# Altium project Drone1_V1.PrjPcb
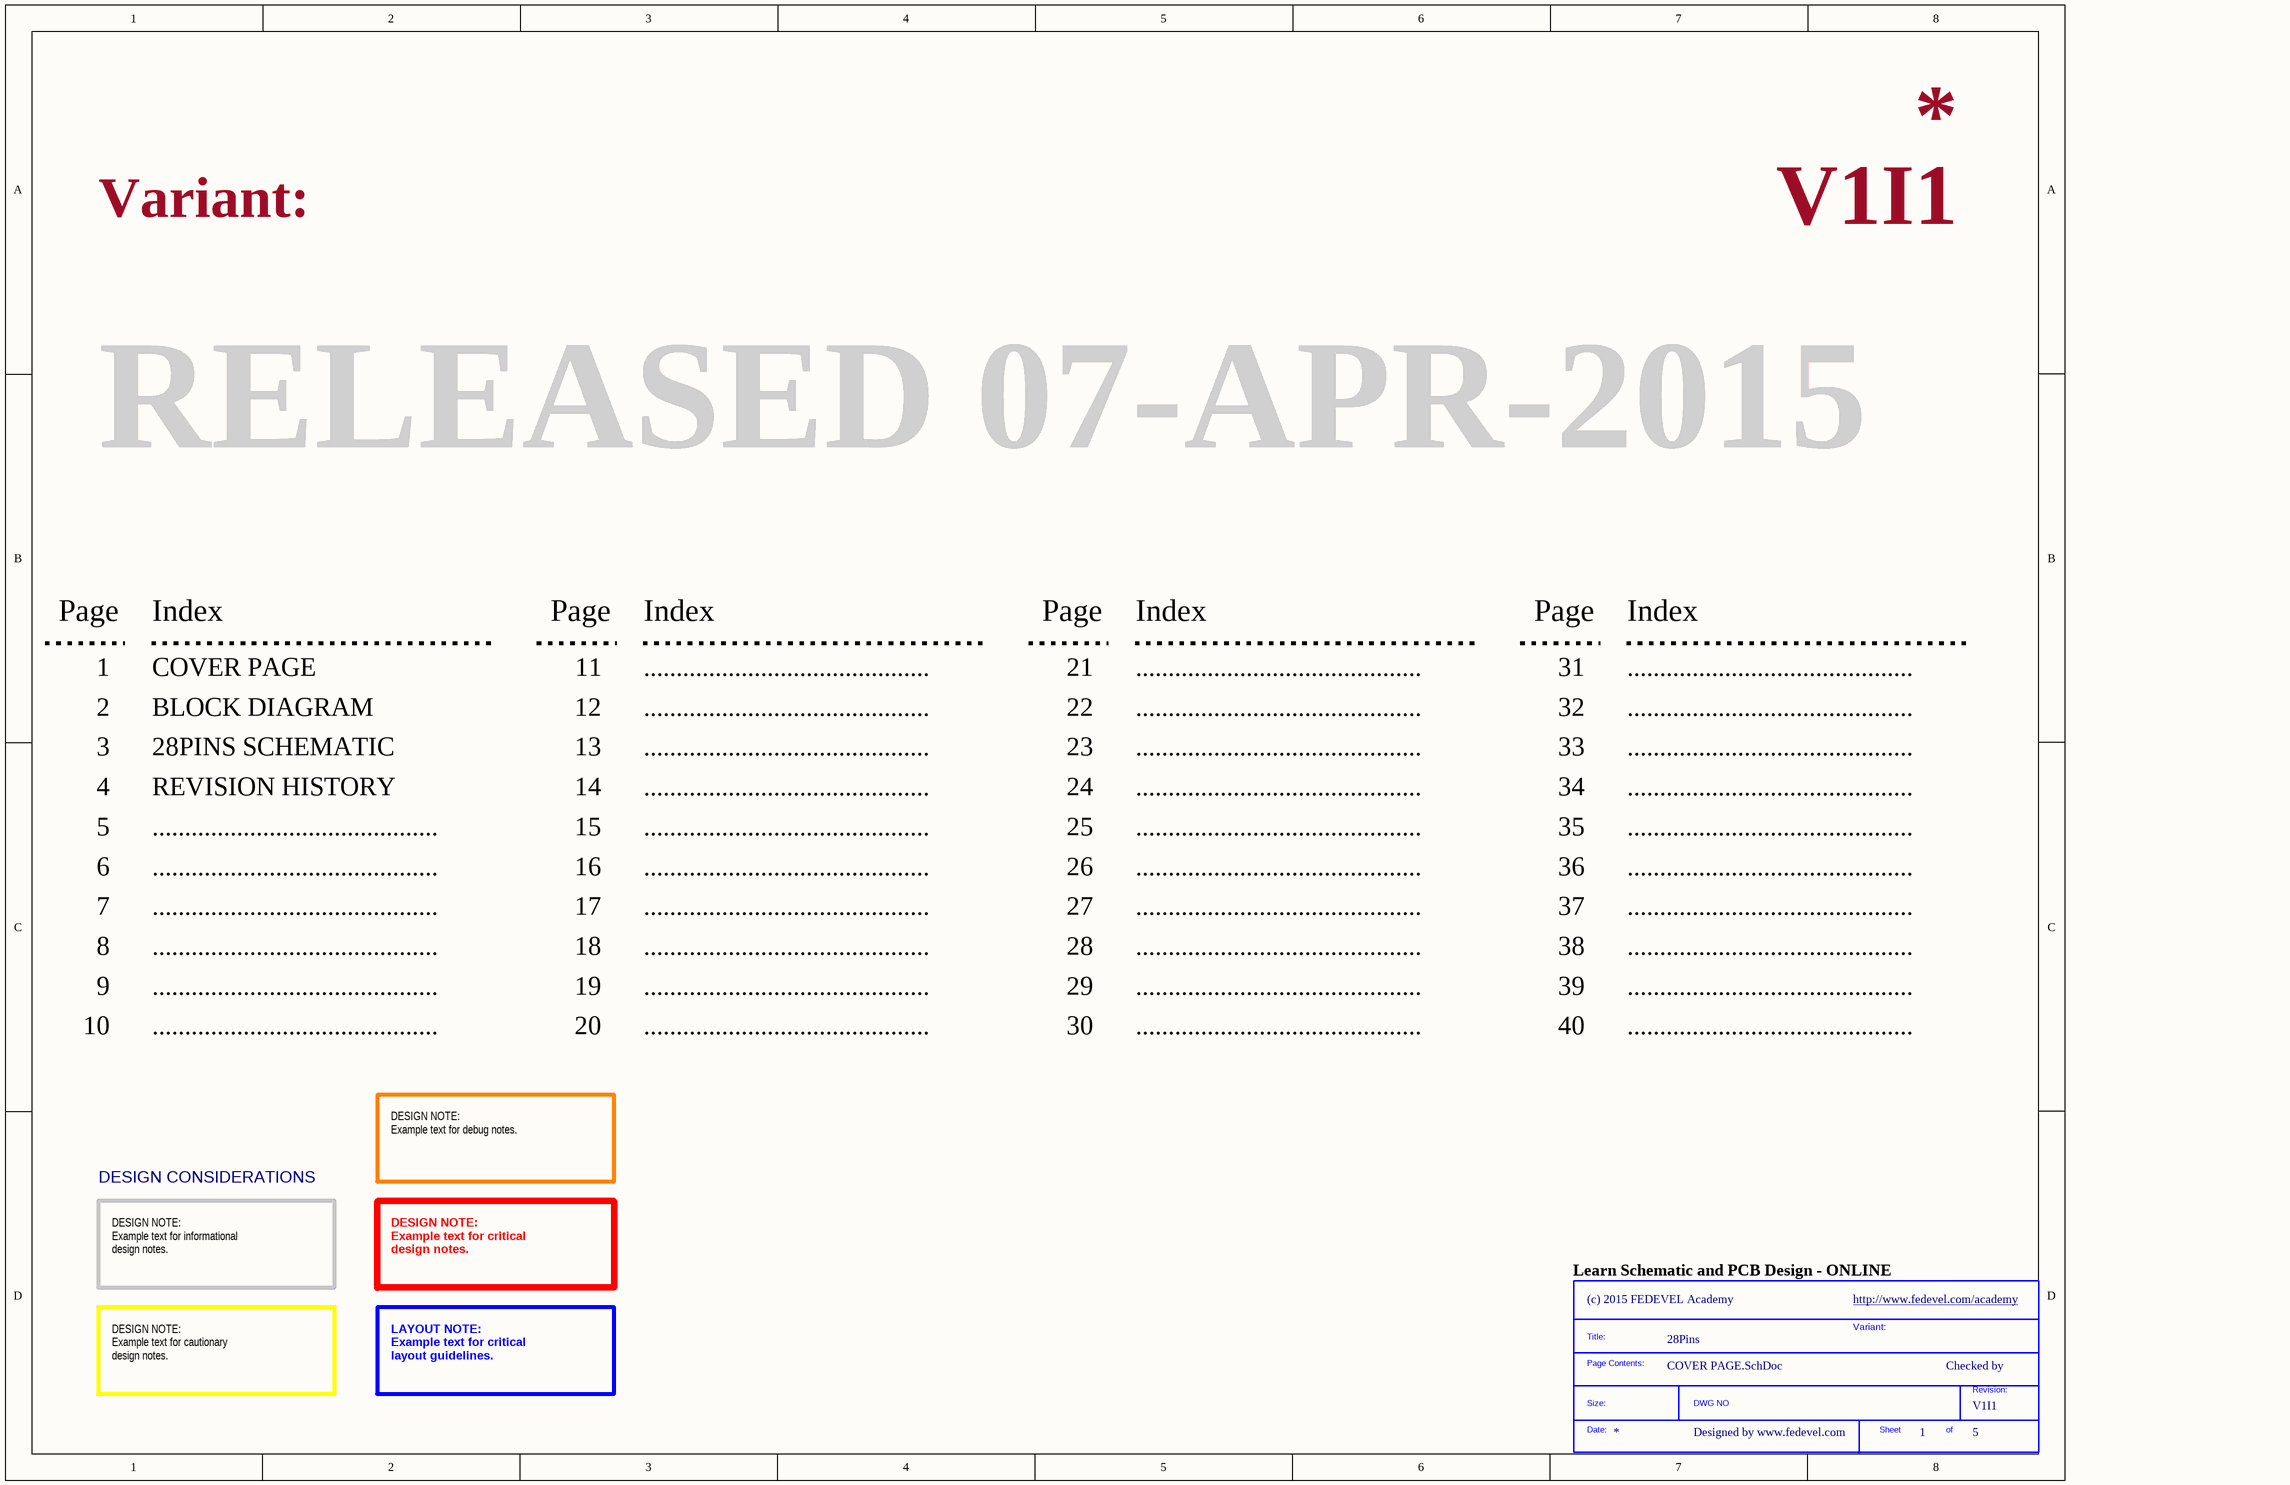
[diagram p0: COVER PAGE.SchDoc]
ClientCompanyName: FEDEVEL Academy; ClientContactEmail: robert.feranec@fedevel.com; ClientContactName: Robert Feranec; ClientWebsite: www.fedevel.com; Company: (c) 2015 FEDEVEL Academy; NotFitted: NF; Project: 28Pins; VersionRevision: V1I1
5 sheets, 23 parts. Net scope: hierarchical (ports join the sheet entries above them; power ports are global).
Sheets:
  COVER PAGE.SchDoc
  Drone1_V1 SCHEMATIC.SchDoc
    U_Moteurs_schem = Moteurs_schem.SchDoc
    U_Mission_schem = Mission_schem.SchDoc
    U_Vol_schem = Vol_schem.SchDoc

## Sheet COVER PAGE.SchDoc
size A3; DocumentNumber: 1; SheetNumber: 1; SheetTotal: 5

### Parts
(Parts that share a designator on the sheet are numbered #1, #2 ... from top to bottom, then left to right.)
*#1  SDTitleBlock  (value not drawn)  (graphical)

### Notes on the sheet
- Variant:
- RELEASED 07-APR-2015
- Page
- Index
- 1
- COVER PAGE
- 11
- ............................................
- 21
- 31
- 2
- 3
- BLOCK DIAGRAM
- 28PINS SCHEMATIC
- 12
- 13
- 22
- 23
- 32
- 33
- 4
- 5
- REVISION HISTORY
- 14
- 15
- 24
- 25
- 34
- 35
- 6
- 16
- 26
- 36
- 7
- 8
- 17
- 18
- 27
- 28
- 37
- 38
- 9
- 10
- 19
- 20
- 29
- 30
- 39
- 40
- DESIGN NOTE:
  Example text for debug notes.
- DESIGN CONSIDERATIONS
- DESIGN NOTE:
  Example text for informational
  design notes.
- DESIGN NOTE:
  Example text for critical
  design notes.
- (near *#1) Learn Schematic and PCB Design - ONLINE
- http://www.fedevel.com/academy
- Checked by
- DESIGN NOTE:
  Example text for cautionary
  design notes.
- LAYOUT NOTE:
  Example text for critical
  layout guidelines.
- Designed by www.fedevel.com
- (in symbol SDTitleBlock) Title:; Page Contents:; Revision:; Size:; DWG NO; Date:; Sheet; of

## Sheet Drone1_V1 SCHEMATIC.SchDoc
size A4; DocumentNumber: 3; SheetNumber: 3; SheetTotal: 5; PageSetup: Record=PageOptions|CenterHorizontal=True|CenterVertical=True|PrintScale=0.73|XCorrection=1.00|YCorrection=1.00|PrintKind=0|BorderSize=5000000|LeftOffset=0|BottomOffset=0|Orientation=2|PaperLength=1000|PaperWidth=1000|Scale=100|PaperSource=7|PrintQuality=-3|MediaType=1|DitherType=10|PrintScaleMode=1|PaperKind=A3|PaperIndex=8
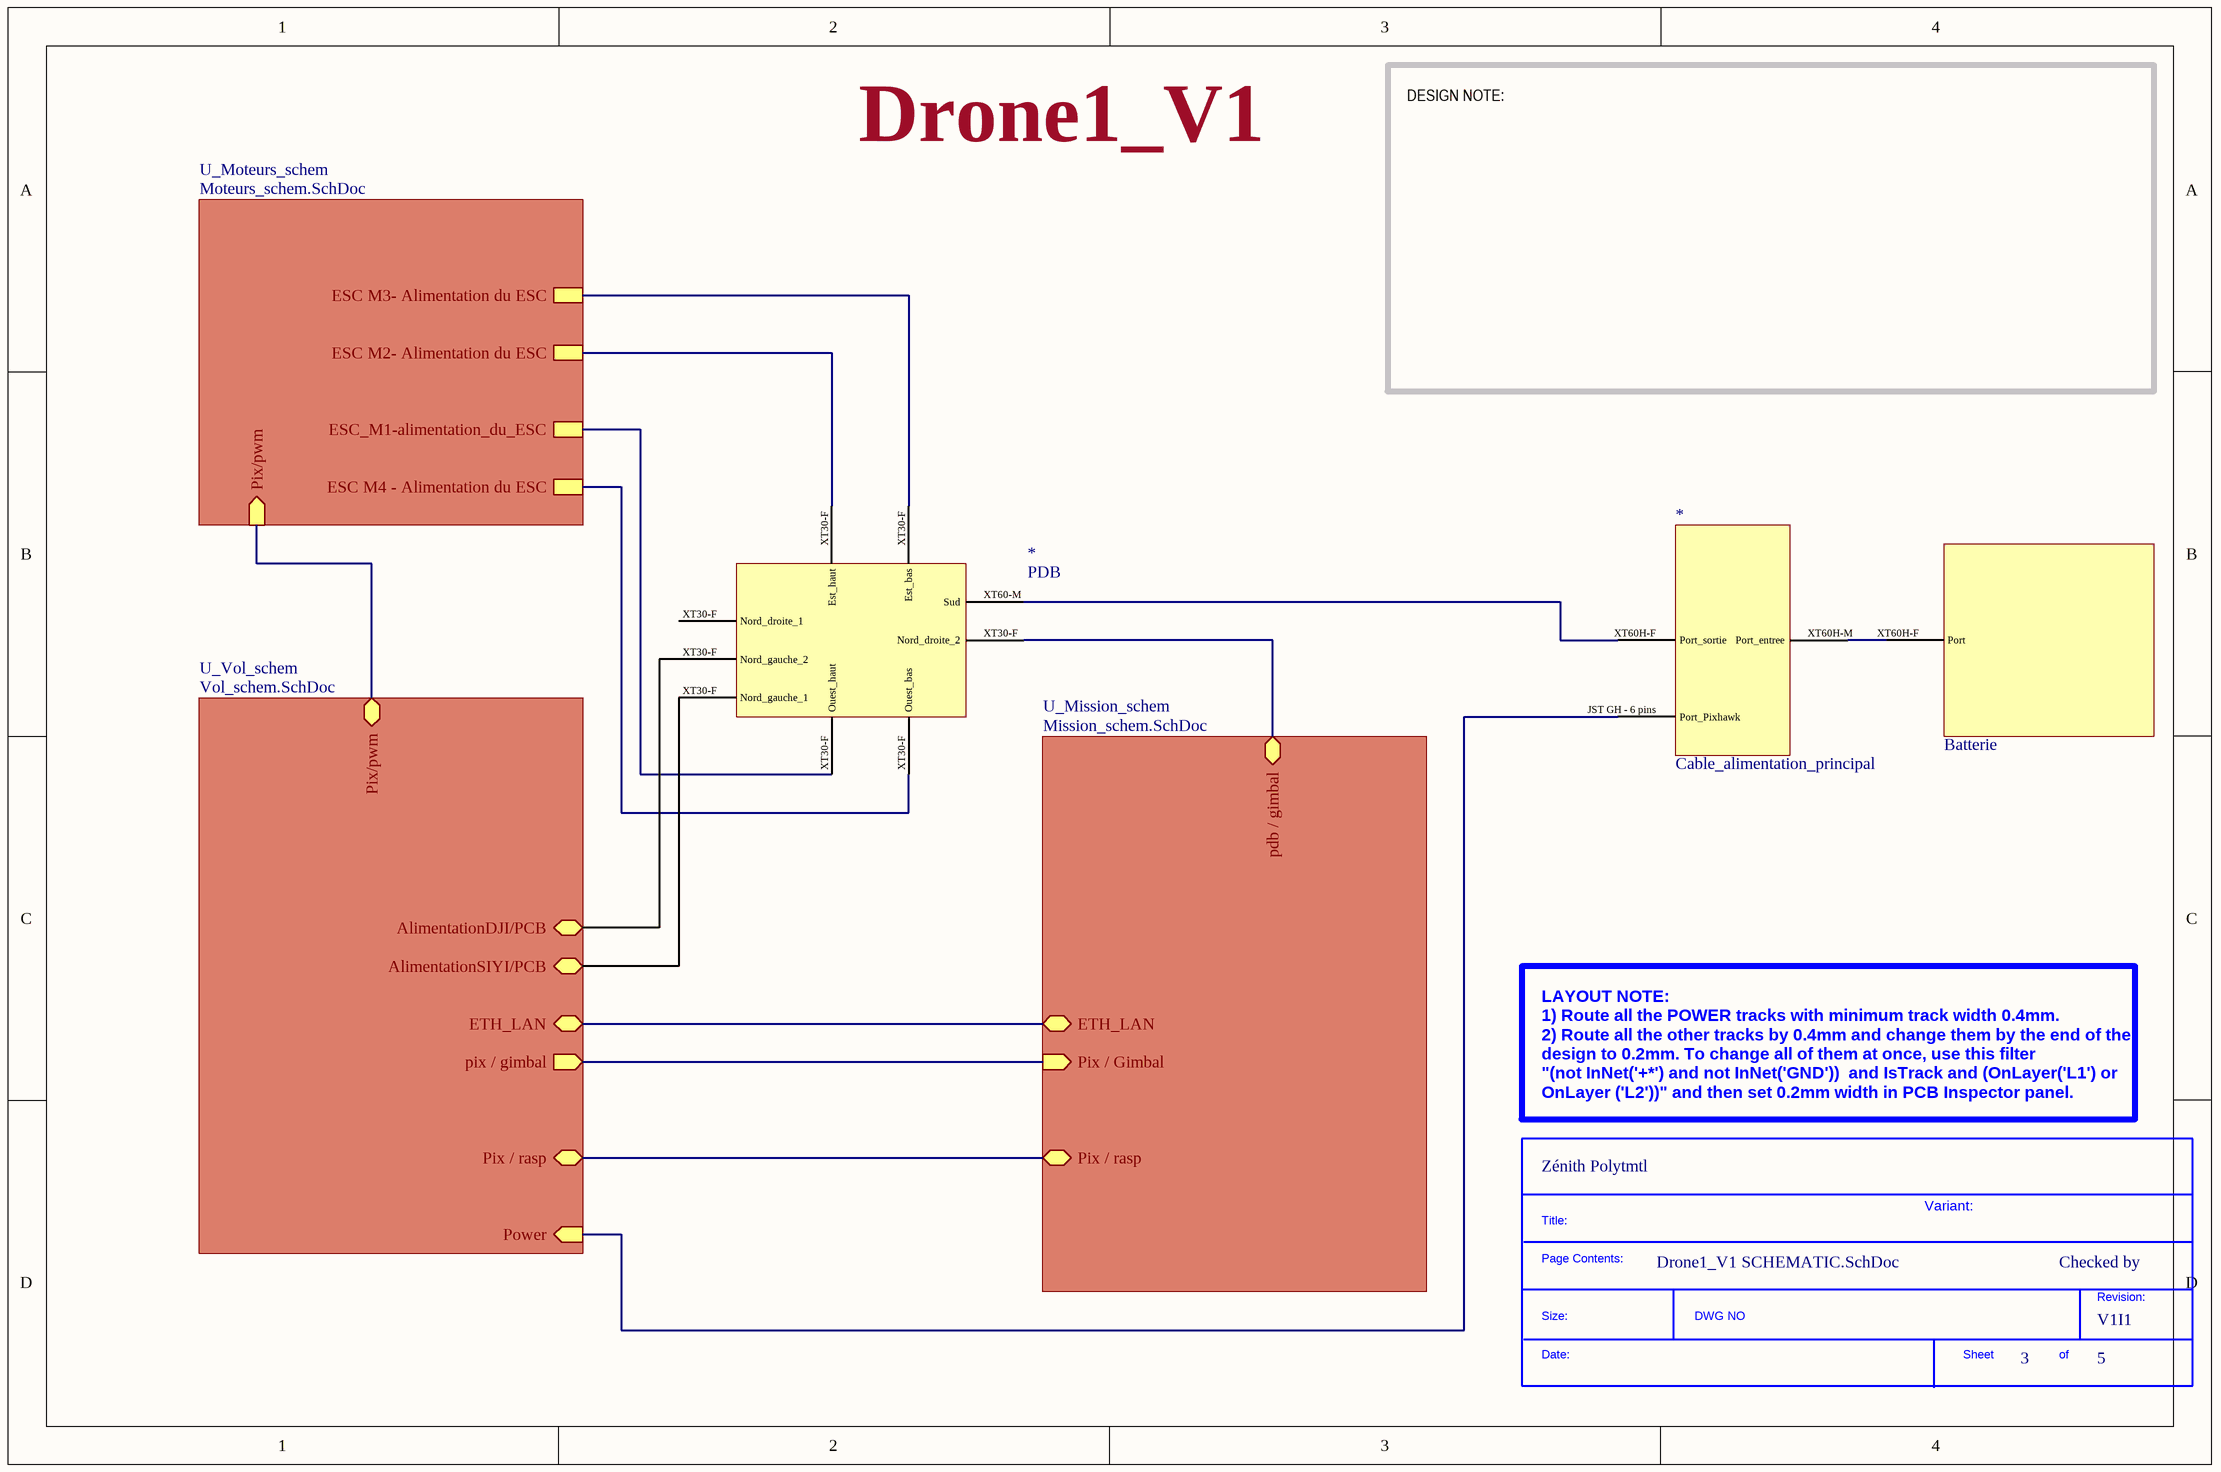
[diagram p1: Drone1_V1 SCHEMATIC.SchDoc]

### Parts
(Parts that share a designator on the sheet are numbered #1, #2 ... from top to bottom, then left to right.)
*#2  Cable_alimentation_principal
*#3  PDB
*#4  SDTitleBlock  (value not drawn)  (graphical)
?  Batterie

### Sub-sheets
U_Mission_schem = Mission_schem.SchDoc: ETH_LAN (bidir), Pix / Gimbal (in), Pix / rasp (bidir), pdb / gimbal (bidir)
U_Moteurs_schem = Moteurs_schem.SchDoc: ESC M3- Alimentation du ESC, ESC_M1-alimentation_du_ESC, ESC M4 - Alimentation du ESC, ESC M2- Alimentation du ESC, Pix/pwm (in)
U_Vol_schem = Vol_schem.SchDoc: ETH_LAN (bidir), Power (in), pix / gimbal (out), Pix / rasp (bidir), Pix/pwm (bidir), AlimentationSIYI/PCB (bidir), AlimentationDJI/PCB (bidir)

### Nets
ESC M2- Alimentation du ESC: *#3.XT30-F(Est_haut) ; sheet U_Moteurs_schem/ESC M2- Alimentation du ESC
ESC M3- Alimentation du ESC: *#3.XT30-F(Est_bas) ; sheet U_Moteurs_schem/ESC M3- Alimentation du ESC
ESC M4 - Alimentation du ESC: *#3.XT30-F(Ouest_bas) ; sheet U_Moteurs_schem/ESC M4 - Alimentation du ESC
ESC_M1-alimentation_du_ESC: *#3.XT30-F(Ouest_haut) ; sheet U_Moteurs_schem/ESC_M1-alimentation_du_ESC
ETH_LAN: sheet U_Mission_schem/ETH_LAN, sheet U_Vol_schem/ETH_LAN
pdb / gimbal: *#3.XT30-F(Nord_droite_2) ; sheet U_Mission_schem/Pix / Gimbal, sheet U_Mission_schem/pdb / gimbal, sheet U_Vol_schem/pix / gimbal
Pix / rasp: sheet U_Mission_schem/Pix / rasp, sheet U_Vol_schem/Pix / rasp
Pix/pwm: sheet U_Moteurs_schem/Pix/pwm, sheet U_Vol_schem/Pix/pwm
Power: *#2.JST_GH_-_6_pins(Port_Pixhawk) ; sheet U_Vol_schem/Power
Net*#2_XT60H-F: *#2.XT60H-F(Port_sortie) *#3.XT60-M(Sud)
Net*#2_XT60H-M: *#2.XT60H-M(Port_entree) ?.XT60H-F(Port)

### Notes on the sheet
- Drone1_V1
- DESIGN NOTE:
- (near *#4) Zénith Polytmtl
- (near *#4) LAYOUT NOTE:
  1) Route all the POWER tracks with minimum track width 0.4mm.
  2) Route all the other tracks by 0.4mm and change them by the end of the design to 0.2mm. To change all of them at once, use this filter
  "(not InNet('+*') and not InNet('GND'))  and IsTrack and (OnLayer('L1') or OnLayer ('L2'))" and then set 0.2mm width in PCB Inspector panel.
- Variant:
- Checked by
- (in symbol SDTitleBlock) Title:; Page Contents:; Revision:; Size:; DWG NO; Date:; Sheet; of

## Sheet Moteurs_schem.SchDoc
size A4
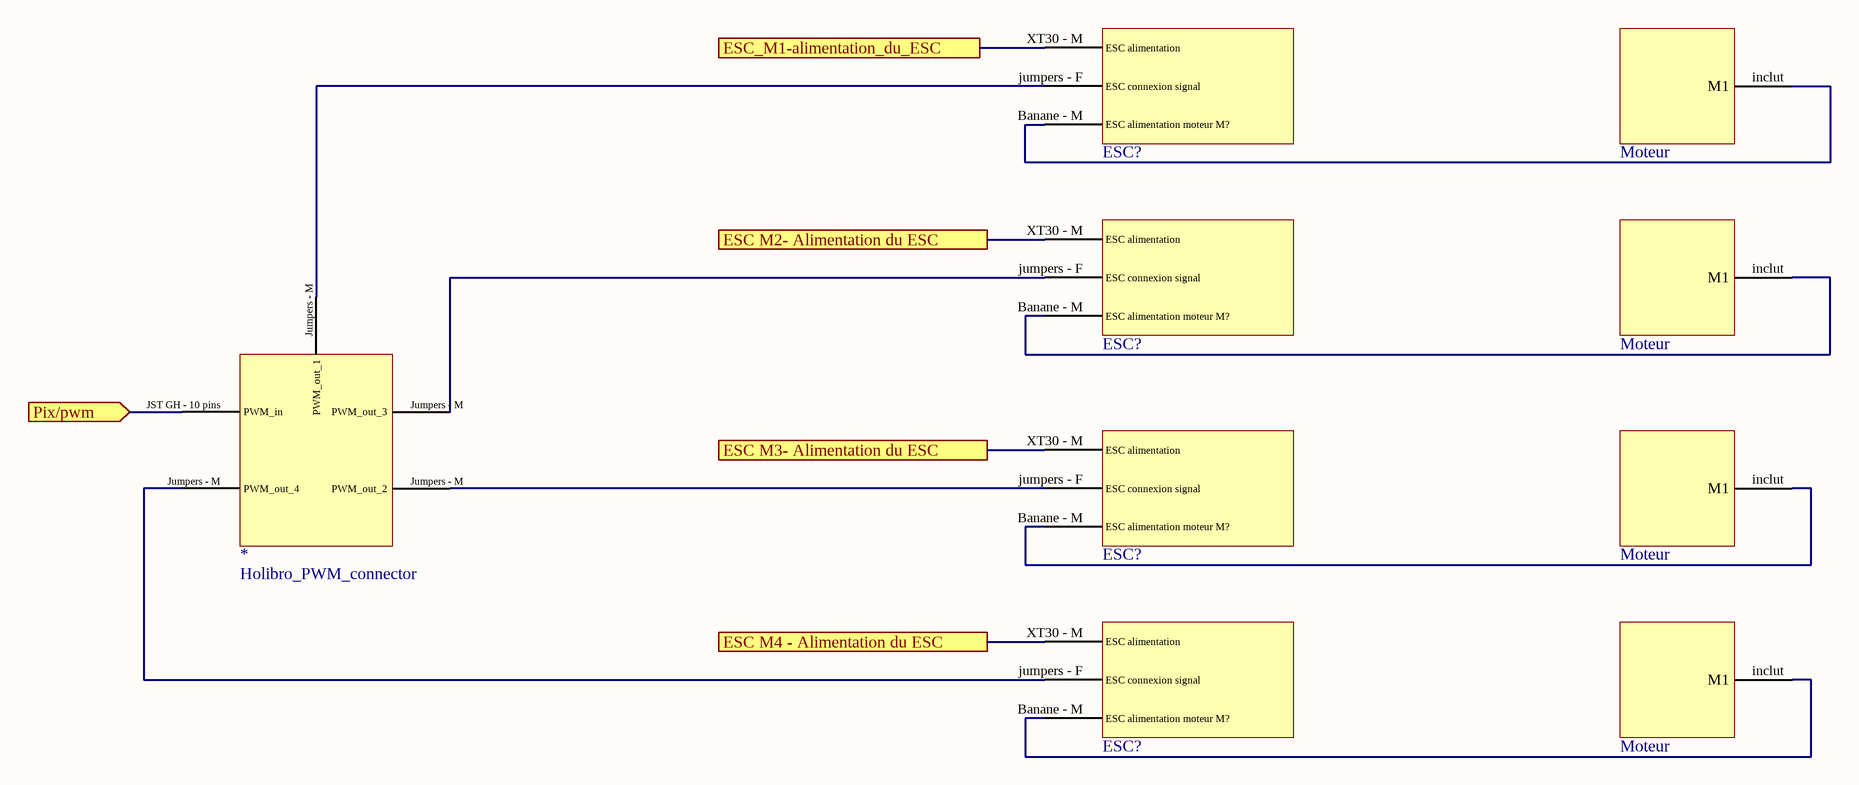
[diagram p2: Moteurs_schem.SchDoc]

### Parts
(Parts that share a designator on the sheet are numbered #1, #2 ... from top to bottom, then left to right.)
*#5  Holibro_PWM_connector
ESC?#1  ESC  (value not drawn)
ESC?#2  ESC  (value not drawn)
ESC?#3  ESC  (value not drawn)
ESC?#4  ESC  (value not drawn)
M?#1  Moteur
M?#2  Moteur
M?#3  Moteur
M?#4  Moteur

### Ports
ESC M2- Alimentation du ESC, ESC M3- Alimentation du ESC, ESC M4 - Alimentation du ESC, ESC_M1-alimentation_du_ESC, Pix/pwm (in)

### Nets
ESC M2- Alimentation du ESC: ESC?#2.XT30_-_M(ESC_alimentation) ; port ESC M2- Alimentation du ESC
ESC M3- Alimentation du ESC: ESC?#3.XT30_-_M(ESC_alimentation) ; port ESC M3- Alimentation du ESC
ESC M4 - Alimentation du ESC: ESC?#4.XT30_-_M(ESC_alimentation) ; port ESC M4 - Alimentation du ESC
ESC_M1-alimentation_du_ESC: ESC?#1.XT30_-_M(ESC_alimentation) ; port ESC_M1-alimentation_du_ESC
Pix/pwm: *#5.JST_GH_-_10_pins(PWM_in) ; port Pix/pwm
Net*#5_Jumpers - M: *#5.Jumpers_-_M(PWM_out_1) ESC?#1.jumpers_-_F(ESC_connexion_signal)
Net*#5_Jumpers - M: *#5.Jumpers_-_M(PWM_out_3) ESC?#2.jumpers_-_F(ESC_connexion_signal)  [a separate net that carries the same name]
Net*#5_Jumpers - M: *#5.Jumpers_-_M(PWM_out_2) ESC?#3.jumpers_-_F(ESC_connexion_signal)  [a separate net that carries the same name]
Net*#5_Jumpers - M: *#5.Jumpers_-_M(PWM_out_4) ESC?#4.jumpers_-_F(ESC_connexion_signal)  [a separate net that carries the same name]
NetESC?#1_Banane - M: ESC?#1.Banane_-_M(ESC_alimentation_moteur_M?) M?#1.inclut(M1)
NetESC?#2_Banane - M: ESC?#2.Banane_-_M(ESC_alimentation_moteur_M?) M?#2.inclut(M1)
NetESC?#3_Banane - M: ESC?#3.Banane_-_M(ESC_alimentation_moteur_M?) M?#3.inclut(M1)
NetESC?#4_Banane - M: ESC?#4.Banane_-_M(ESC_alimentation_moteur_M?) M?#4.inclut(M1)

## Sheet Mission_schem.SchDoc
size A4
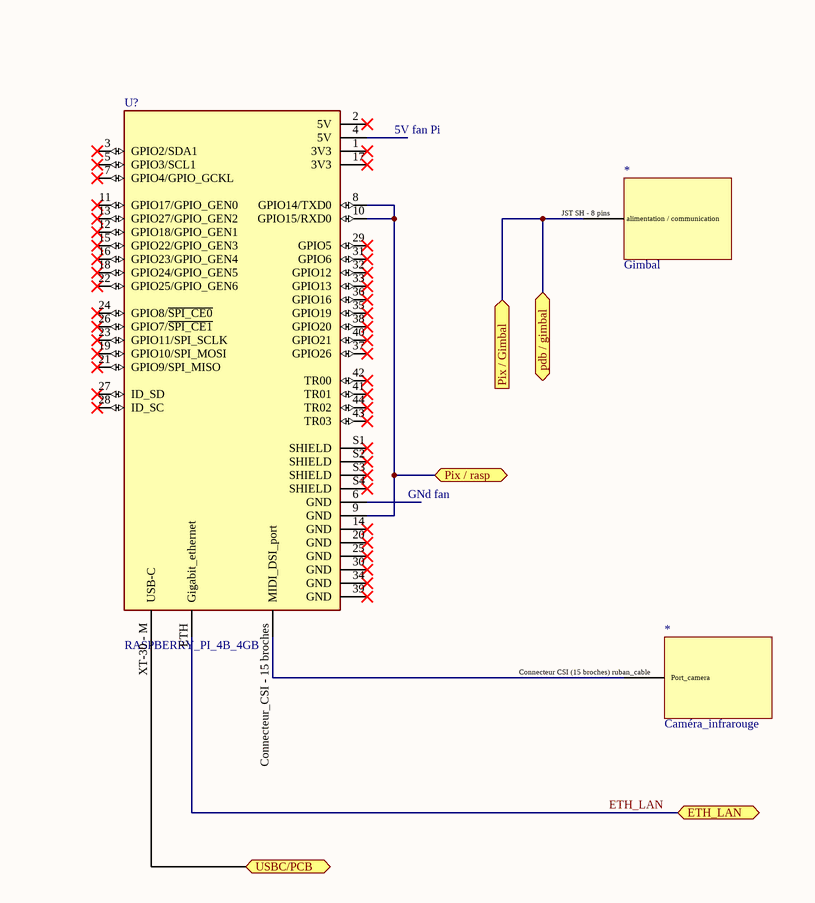
[diagram p3: Mission_schem.SchDoc, right]

### Parts
(Parts that share a designator on the sheet are numbered #1, #2 ... from top to bottom, then left to right.)
*#6  Gimbal
*#7  Caméra_infrarouge
U?  RASPBERRY_PI_4B_4GB  [MODULE_RASPBERRY_PI_4B_4GB]

### Ports
ETH_LAN (bidir), pdb / gimbal (bidir), Pix / Gimbal (in), Pix / rasp (bidir), USBC/PCB (bidir)

### Nets
ETH_LAN: U?.ETH(Gigabit_ethernet) ; port ETH_LAN
pdb / gimbal: *#6.JST_SH_-_8_pins(alimentation_/_communication) ; port Pix / Gimbal, port pdb / gimbal
Pix / rasp: U?.8(GPIO14/TXD0) U?.9(GND) U?.10(GPIO15/RXD0) ; port Pix / rasp
Net*#7_Connecteur CSI (15 broches) ruban_cable: *#7.Connecteur_CSI_(15_broches)_ruban_cable(Port_camera) U?.Connecteur_CSI_-_15_broches(MIDI_DSI_port)

Not connected (* = marked no-connect by the designer): U? 1(3V3)* 2(5V)* 3(GPIO2/SDA1)* 4(5V) 5(GPIO3/SCL1)* 6(GND) 7(GPIO4/GPIO_GCKL)* 11(GPIO17/GPIO_GEN0)* 12(GPIO18/GPIO_GEN1)* 13(GPIO27/GPIO_GEN2)* 14(GND)* 15(GPIO22/GPIO_GEN3)* 16(GPIO23/GPIO_GEN4)* 17(3V3)* 18(GPIO24/GPIO_GEN5)* 19(GPIO10/SPI_MOSI)* 20(GND)* 21(GPIO9/SPI_MISO)* 22(GPIO25/GPIO_GEN6)* 23(GPIO11/SPI_SCLK)* 24(GPIO8/~{SPI_CE0})* 25(GND)* 26(GPIO7/~{SPI_CE1})* 27(ID_SD)* 28(ID_SC)* 29(GPIO5)* 30(GND)* 31(GPIO6)* 32(GPIO12)* 33(GPIO13)* 34(GND)* 35(GPIO19)* 36(GPIO16)* 37(GPIO26)* 38(GPIO20)* 39(GND)* 40(GPIO21)* 41(TR01)* 42(TR00)* 43(TR03)* 44(TR02)* S1(SHIELD)* S2(SHIELD)* S3(SHIELD)* S4(SHIELD)* XT-30 - M(USB-C_)

### Notes on the sheet
- 5V fan Pi
- GNd fan

### Library data of the parts
U? = RASPBERRY_PI_4B_4GB: BCM2711 Raspberry Pi 4 Model B 4GB - ARMÂ® CortexÂ®-A72 MPU Embedded Evaluation Board; MP: RASPBERRY PI 4B/4GB; SnapEDA_Link: https://www.snapeda.com/parts/RASPBERRY%20PI%204B/4GB/Raspberry+Pi/view-part/?ref=snap; Package: None; Value: *; MF: Raspberry Pi; Check_prices: https://www.snapeda.com/parts/RASPBERRY%20PI%204B/4GB/Raspberry+Pi/view-part/?ref=eda

## Sheet Vol_schem.SchDoc
size A4
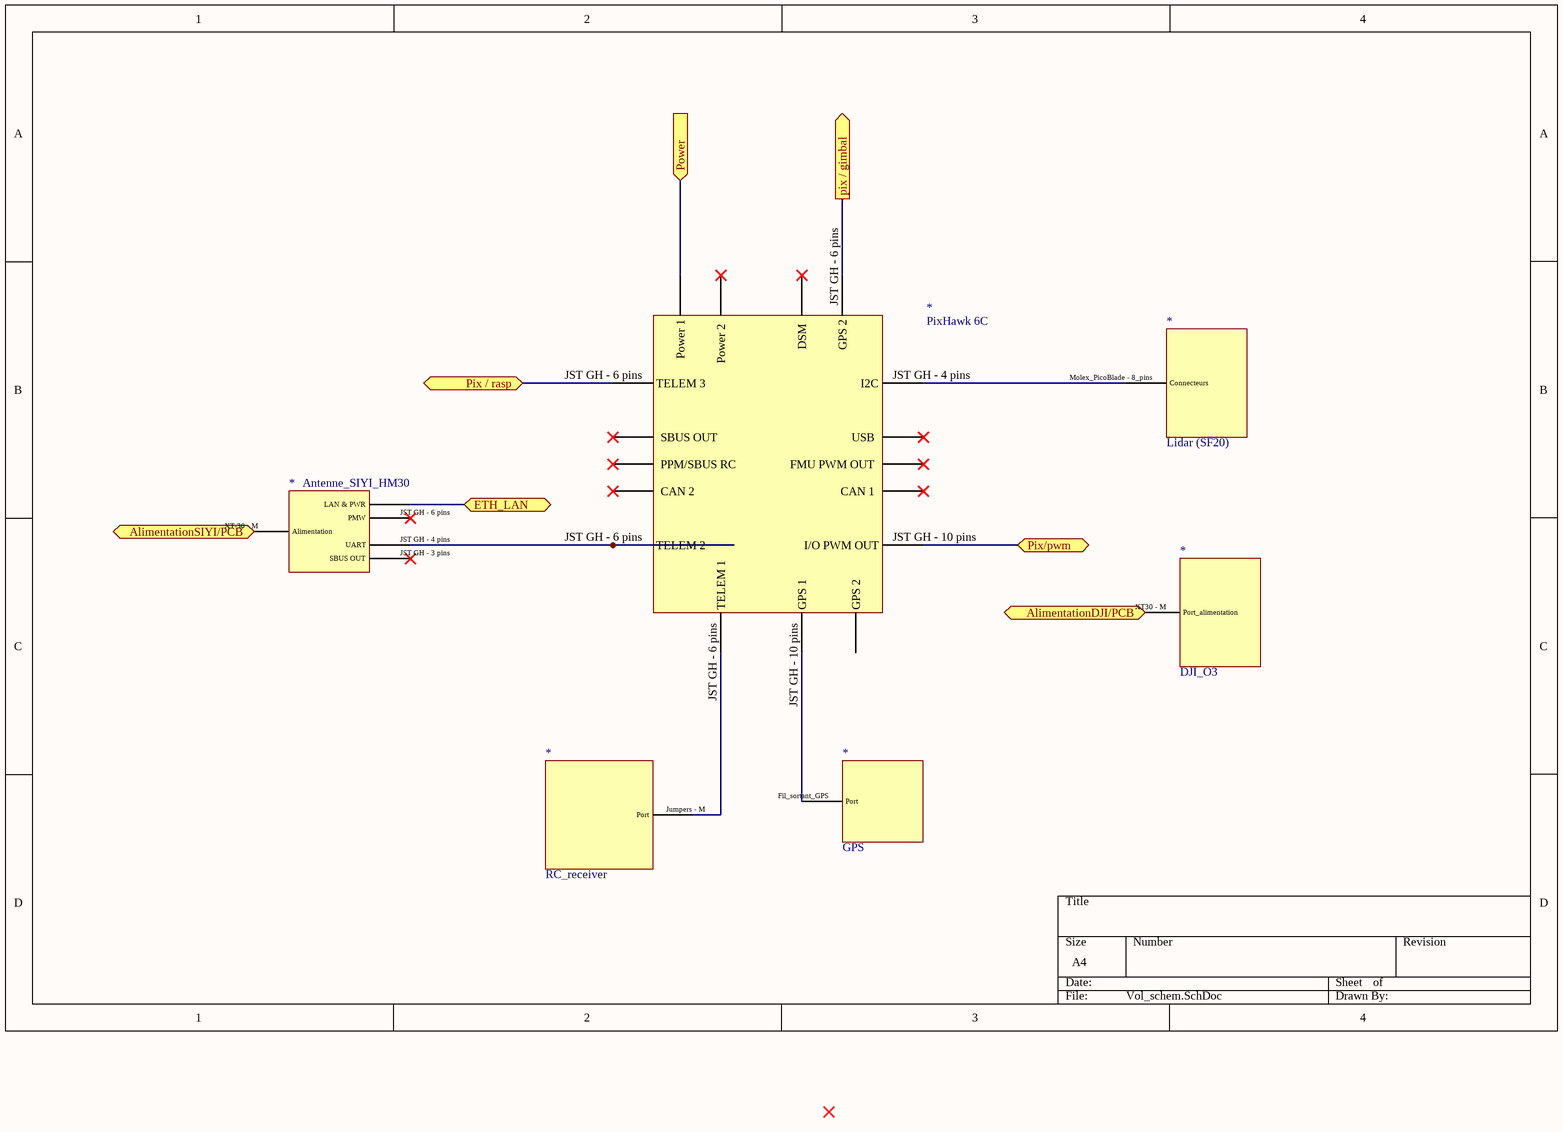
[diagram p4: Vol_schem.SchDoc]

### Parts
(Parts that share a designator on the sheet are numbered #1, #2 ... from top to bottom, then left to right.)
*#8  Lidar (SF20)
*#9  PixHawk 6C
*#10  Antenne_SIYI_HM30
*#11  DJI_O3
*#12  GPS
*#13  RC_receiver

### Ports
AlimentationDJI/PCB (bidir), AlimentationSIYI/PCB (bidir), ETH_LAN (bidir), pix / gimbal (out), Pix / rasp (bidir), Pix/pwm (bidir), Power (in)

### Nets
ETH_LAN: *#10.?1(LAN_&_PWR) ; port ETH_LAN
pdb / gimbal: *#9.JST_GH_-_6_pins(GPS_2) ; port pix / gimbal
Pix / rasp: *#9.JST_GH_-_6_pins(TELEM_3) ; port Pix / rasp
Pix/pwm: *#9.JST_GH_-_10_pins(I/O_PWM_OUT) ; port Pix/pwm
Power: *#9.?1(Power_1) ; port Power
Net*#8_Molex_PicoBlade - 8_pins: *#8.Molex_PicoBlade_-_8_pins(Connecteurs) *#9.JST_GH_-_4_pins(I2C)
Net*#9_JST GH - 6 pins: *#9.JST_GH_-_6_pins(TELEM_2) *#10.JST_GH_-_4_pins(UART)
Net*#9_JST GH - 6 pins: *#9.JST_GH_-_6_pins(TELEM_1) *#13.Jumpers_-_M(Port)  [a separate net that carries the same name]
Net*#9_JST GH - 10 pins: *#9.JST_GH_-_10_pins(GPS_1) *#12.Fil_sortant_GPS(Port)

Not connected (* = marked no-connect by the designer): *#9 ?2(Power_2)* ?3(DSM)* ?4(USB)* ?5(CAN_1)* ?6(SBUS_OUT)* ?7(CAN_2)* ?8(GPS_2) ?9(FMU_PWM_OUT)* ?10(PPM/SBUS_RC)*; *#10 JST GH - 3 pins(SBUS_OUT)* JST GH - 6 pins(PMW)* XT-30 - M(Alimentation); *#11 XT30 - M(Port_alimentation)

### Library data of the parts
*#8 = DJI_O3

## Nets that join several sheets
ESC M2- Alimentation du ESC: Drone1_V1 SCHEMATIC (*#3.XT30-F), Moteurs_schem (ESC?#2.XT30 - M)
ESC M3- Alimentation du ESC: Drone1_V1 SCHEMATIC (*#3.XT30-F), Moteurs_schem (ESC?#3.XT30 - M)
ESC M4 - Alimentation du ESC: Drone1_V1 SCHEMATIC (*#3.XT30-F), Moteurs_schem (ESC?#4.XT30 - M)
ESC_M1-alimentation_du_ESC: Drone1_V1 SCHEMATIC (*#3.XT30-F), Moteurs_schem (ESC?#1.XT30 - M)
ETH_LAN: Mission_schem (U?.ETH), Vol_schem (*#10.?1)
pdb / gimbal: Drone1_V1 SCHEMATIC (*#3.XT30-F), Mission_schem (*#6.JST SH - 8 pins), Vol_schem (*#9.JST GH - 6 pins)
Pix / rasp: Mission_schem (U?.8 U?.9 U?.10), Vol_schem (*#9.JST GH - 6 pins)
Pix/pwm: Moteurs_schem (*#5.JST GH - 10 pins), Vol_schem (*#9.JST GH - 10 pins)
Power: Drone1_V1 SCHEMATIC (*#2.JST GH - 6 pins), Vol_schem (*#9.?1)

## Assembly variants
FIXED 5V: all parts fitted
5V/3V3: all parts fitted